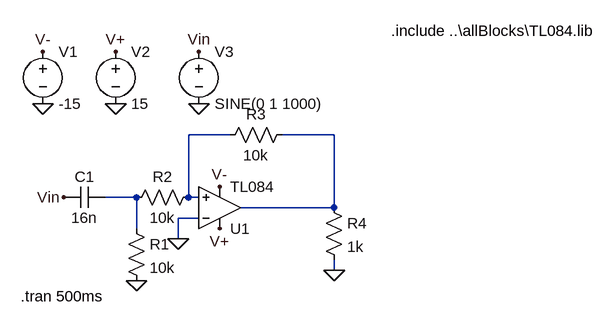
[diagram p0: schematic phaseShifter.asc]
phaseShifter.asc, the LTspice schematic file:
Version 4
SHEET 1 884 680
WIRE 288 32 224 32
WIRE 448 32 368 32
WIRE 144 128 96 128
WIRE 224 128 224 32
WIRE 240 128 224 128
WIRE 448 144 448 32
WIRE 448 144 304 144
WIRE 240 160 208 160
WIRE 144 176 144 128
WIRE 208 192 208 160
WIRE 448 240 448 224
FLAG 0 -16 0
FLAG 112 -16 0
FLAG 240 -16 0
FLAG 0 -96 V-
FLAG 112 -96 V+
FLAG 272 176 V+
FLAG 272 112 V-
FLAG 240 -96 Vin
FLAG 144 256 0
FLAG 208 192 0
FLAG 32 128 Vin
FLAG 448 240 0
SYMBOL Opamps\\opamp2 272 208 M180
SYMATTR InstName U1
SYMATTR Value TL084
SYMBOL voltage 0 -112 R0
WINDOW 123 0 0 Left 0
WINDOW 39 0 0 Left 0
SYMATTR InstName V1
SYMATTR Value -15
SYMBOL voltage 112 -112 R0
WINDOW 123 0 0 Left 0
WINDOW 39 0 0 Left 0
SYMATTR InstName V2
SYMATTR Value 15
SYMBOL voltage 240 -112 R0
WINDOW 123 0 0 Left 0
WINDOW 39 0 0 Left 0
SYMATTR InstName V3
SYMATTR Value SINE(0 1 1000)
SYMBOL res 128 160 R0
SYMATTR InstName R1
SYMATTR Value 10k
SYMBOL cap 96 112 R90
WINDOW 0 0 32 VBottom 2
WINDOW 3 32 32 VTop 2
SYMATTR InstName C1
SYMATTR Value 16n
SYMBOL res 384 16 R90
WINDOW 0 0 56 VBottom 2
WINDOW 3 32 56 VTop 2
SYMATTR InstName R3
SYMATTR Value 10k
SYMBOL res 432 128 R0
SYMATTR InstName R4
SYMATTR Value 1k
SYMBOL res 240 112 R90
WINDOW 0 0 56 VBottom 2
WINDOW 3 32 56 VTop 2
SYMATTR InstName R2
SYMATTR Value 10k
TEXT -34 280 Left 2 !.tran 500ms
TEXT 536 -128 Left 2 !.include ..\\allBlocks\\TL084.lib

The netlist it stands for:
* phaseShifter.asc
XU1 N001 0 V+ V- N002 TL084  ; pins In+ In- V+ V- OUT
V1 V- 0 -15
V2 V+ 0 15
V3 Vin 0 SINE(0 1 1000)
R1 N003 0 10k
C1 N003 Vin 16n
R3 N002 N001 10k
R4 N002 0 1k
R2 N001 N003 10k
.tran 500ms
.include ..\allBlocks\TL084.lib
.backanno
.end